# Altium schematic sheet connections.schdoc
size 209 x 297 mm; Scale: 1:1; DocumentType: Схема электрическая принципиальная; FirstReferrence: АБВГ.123456.001; PageSetup: Record=PageOptions|CenterHorizontal=False|CenterVertical=False|PrintScale=0.95|XCorrection=0.00|YCorrection=0.00|PrintKind=1|BorderSize=5000000|LeftOffset=0|BottomOffset=0|Orientation=1|PaperLength=1000|PaperWidth=1000|Scale=100|PaperSource=15|PrintQuality=600|MediaType=1|DitherType=10|PaperKind=A4|PrintScaleMode=1
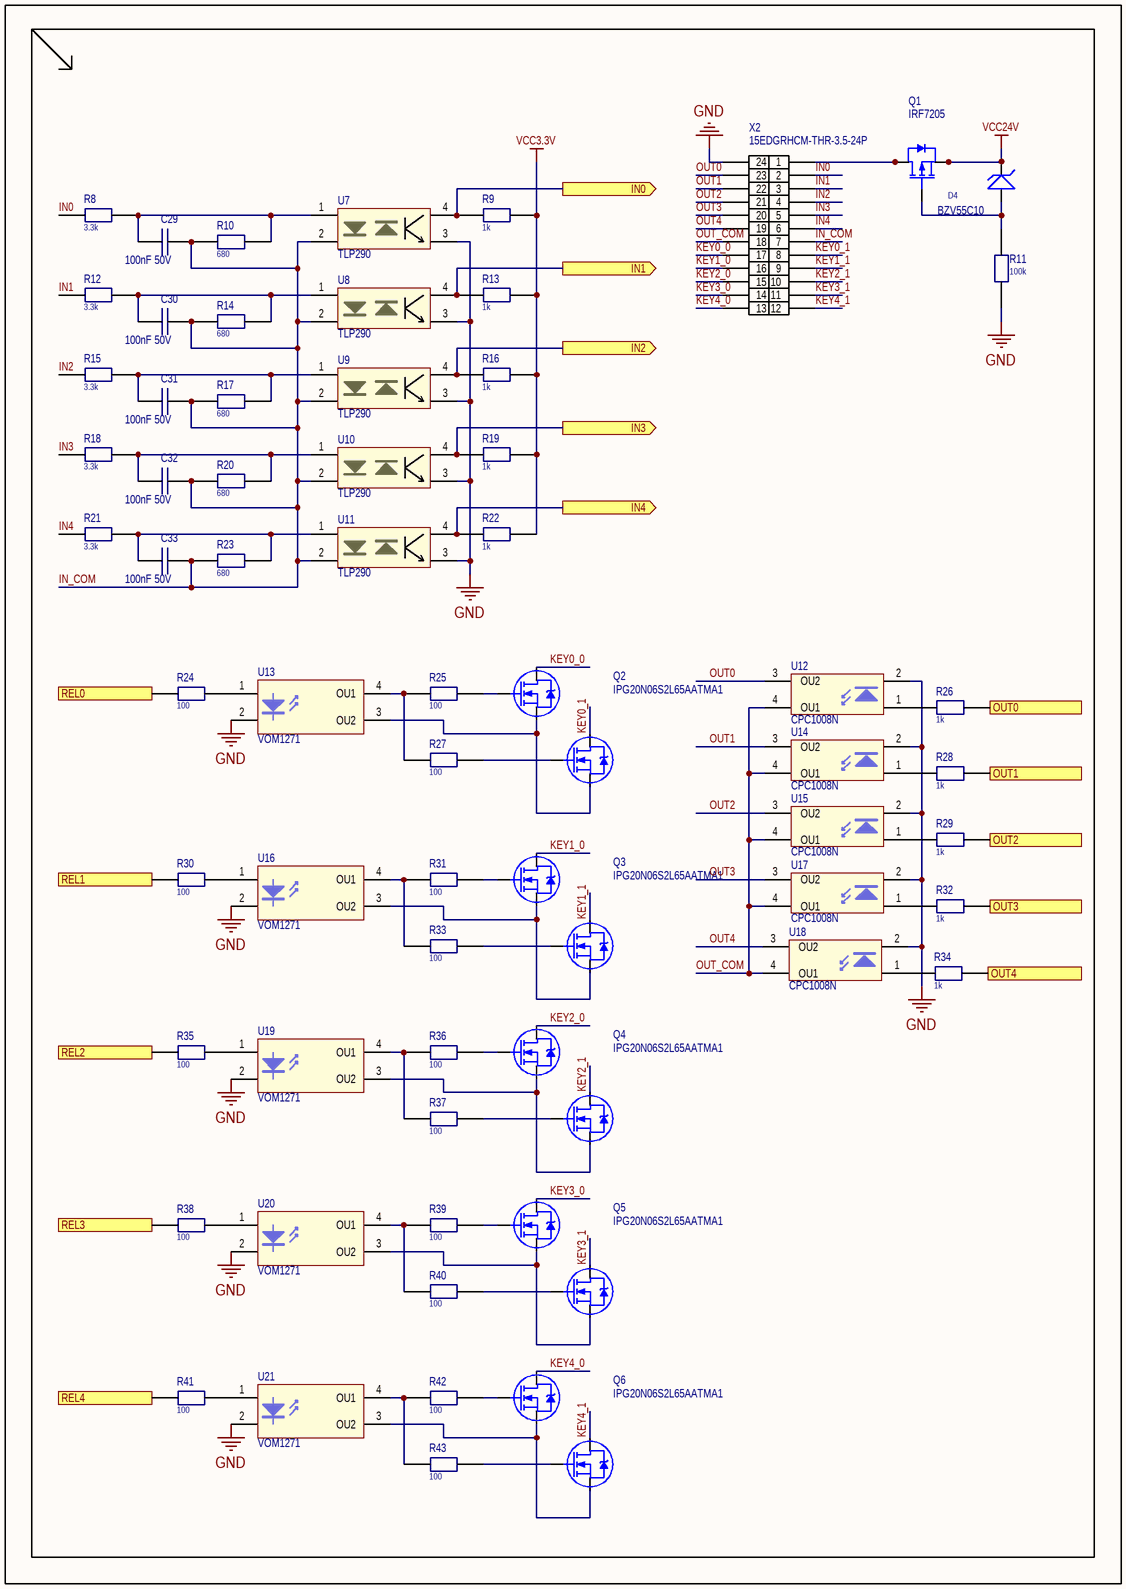
[diagram p0: connections.schdoc]

## Parts
C29  100nF 50V  [C_0603]
C30  100nF 50V  [C_0603]
C31  100nF 50V  [C_0603]
C32  100nF 50V  [C_0603]
C33  100nF 50V  [C_0603]
D4  BZV55C10  [SOD80C]
Q1  IRF7205  [SO-8_M]
Q2  IPG20N06S2L65AATMA1  [PowerFlat 5x6]
Q3  IPG20N06S2L65AATMA1  [PowerFlat 5x6]
Q4  IPG20N06S2L65AATMA1  [PowerFlat 5x6]
Q5  IPG20N06S2L65AATMA1  [PowerFlat 5x6]
Q6  IPG20N06S2L65AATMA1  [PowerFlat 5x6]
R8  3.3k  [R_0603]
R9  1k  [R_0603]
R10  680  [R_0603]
R11  100k  [R_0603]
R12  3.3k  [R_0603]
R13  1k  [R_0603]
R14  680  [R_0603]
R15  3.3k  [R_0603]
R16  1k  [R_0603]
R17  680  [R_0603]
R18  3.3k  [R_0603]
R19  1k  [R_0603]
R20  680  [R_0603]
R21  3.3k  [R_0603]
R22  1k  [R_0603]
R23  680  [R_0603]
R24  100  [R_0603]
R25  100  [R_0603]
R26  1k  [R_0603]
R27  100  [R_0603]
R28  1k  [R_0603]
R29  1k  [R_0603]
R30  100  [R_0603]
R31  100  [R_0603]
R32  1k  [R_0603]
R33  100  [R_0603]
R34  1k  [R_0603]
R35  100  [R_0603]
R36  100  [R_0603]
R37  100  [R_0603]
R38  100  [R_0603]
R39  100  [R_0603]
R40  100  [R_0603]
R41  100  [R_0603]
R42  100  [R_0603]
R43  100  [R_0603]
U7  TLP290  [SO4_1.27]
U8  TLP290  [SO4_1.27]
U9  TLP290  [SO4_1.27]
U10  TLP290  [SO4_1.27]
U11  TLP290  [SO4_1.27]
U12  CPC1008N  [SO4_2_54]
U13  VOM1271  [SOP-4]
U14  CPC1008N  [SO4_2_54]
U15  CPC1008N  [SO4_2_54]
U16  VOM1271  [SOP-4]
U17  CPC1008N  [SO4_2_54]
U18  CPC1008N  [SO4_2_54]
U19  VOM1271  [SOP-4]
U20  VOM1271  [SOP-4]
U21  VOM1271  [SOP-4]
X2  15EDGRHCM-THR-3.5-24P  [DMC 1,5/12-G1F-3,5-LRP20THRR72]

## Ports
IN0 (out), IN1 (out), IN2 (out), IN3 (out), IN4 (out), OUT0 (in), OUT1 (in), OUT2 (in), OUT3 (in), OUT4 (in), REL0 (in), REL1 (in), REL2 (in), REL3 (in), REL4 (in)

## Nets
GND: R11.2 U7.3 U8.3 U9.3 U10.3 U11.3 U12.2(K) U13.2(K) U14.2(K) U15.2(K) U16.2(K) U17.2(K) U18.2(K) U19.2(K) U20.2(K) U21.2(K) X2.24
VCC3.3V: R9.2 R13.2 R16.2 R19.2 R22.2
VCC24V: D4.2(K) Q1.1(S) Q1.2(S) Q1.3(S)
IN0: R8.1 X2.2
IN0: R9.1 U7.4 ; port IN0  [a separate net that carries the same name]
IN1: R12.1 X2.3
IN1: R13.1 U8.4 ; port IN1  [a separate net that carries the same name]
IN2: R15.1 X2.4
IN2: R16.1 U9.4 ; port IN2  [a separate net that carries the same name]
IN3: R18.1 X2.5
IN3: R19.1 U10.4 ; port IN3  [a separate net that carries the same name]
IN4: R21.1 X2.6
IN4: R22.1 U11.4 ; port IN4  [a separate net that carries the same name]
IN_COM: C29.1 C30.1 C31.1 C32.1 C33.1 R10.1 R14.1 R17.1 R20.1 R23.1 U7.2 U8.2 U9.2 U10.2 U11.2 X2.7
KEY0_0: Q2.3(D) X2.17
KEY0_1: Q2.6(D) X2.8
KEY1_0: Q3.3(D) X2.16
KEY1_1: Q3.6(D) X2.9
KEY2_0: Q4.3(D) X2.15
KEY2_1: Q4.6(D) X2.10
KEY3_0: Q5.3(D) X2.14
KEY3_1: Q5.6(D) X2.11
KEY4_0: Q6.3(D) X2.13
KEY4_1: Q6.6(D) X2.12
OUT0: U12.3(OU2) X2.23
OUT0: R26.2 ; port OUT0  [a separate net that carries the same name]
OUT1: U14.3(OU2) X2.22
OUT1: R28.2 ; port OUT1  [a separate net that carries the same name]
OUT2: U15.3(OU2) X2.21
OUT2: R29.2 ; port OUT2  [a separate net that carries the same name]
OUT3: U17.3(OU2) X2.20
OUT3: R32.2 ; port OUT3  [a separate net that carries the same name]
OUT4: U18.3(OU2) X2.19
OUT4: R34.2 ; port OUT4  [a separate net that carries the same name]
OUT_COM: U12.4(OU1) U14.4(OU1) U15.4(OU1) U17.4(OU1) U18.4(OU1) X2.18
REL0: R24.1 ; port REL0
REL1: R30.1 ; port REL1
REL2: R35.1 ; port REL2
REL3: R38.1 ; port REL3
REL4: R41.1 ; port REL4
NetC29_2: C29.2 R8.2 R10.2 U7.1
NetC30_2: C30.2 R12.2 R14.2 U8.1
NetC31_2: C31.2 R15.2 R17.2 U9.1
NetC32_2: C32.2 R18.2 R20.2 U10.1
NetC33_2: C33.2 R21.2 R23.2 U11.1
NetD4_1: D4.1(A) Q1.4(G) R11.1
NetQ1_5: Q1.5(D) Q1.6(D) Q1.7(D) Q1.8(D) X2.1
NetQ2_1: Q2.1(G) R25.2
NetQ2_2: Q2.2(S) Q2.5(S) U13.3(OU2)
NetQ2_4: Q2.4(G) R27.2
NetQ3_1: Q3.1(G) R31.2
NetQ3_2: Q3.2(S) Q3.5(S) U16.3(OU2)
NetQ3_4: Q3.4(G) R33.2
NetQ4_1: Q4.1(G) R36.2
NetQ4_2: Q4.2(S) Q4.5(S) U19.3(OU2)
NetQ4_4: Q4.4(G) R37.2
NetQ5_1: Q5.1(G) R39.2
NetQ5_2: Q5.2(S) Q5.5(S) U20.3(OU2)
NetQ5_4: Q5.4(G) R40.2
NetQ6_1: Q6.1(G) R42.2
NetQ6_2: Q6.2(S) Q6.5(S) U21.3(OU2)
NetQ6_4: Q6.4(G) R43.2
NetR24_2: R24.2 U13.1(A)
NetR25_1: R25.1 R27.1 U13.4(OU1)
NetR26_1: R26.1 U12.1(A)
NetR28_1: R28.1 U14.1(A)
NetR29_1: R29.1 U15.1(A)
NetR30_2: R30.2 U16.1(A)
NetR31_1: R31.1 R33.1 U16.4(OU1)
NetR32_1: R32.1 U17.1(A)
NetR34_1: R34.1 U18.1(A)
NetR35_2: R35.2 U19.1(A)
NetR36_1: R36.1 R37.1 U19.4(OU1)
NetR38_2: R38.2 U20.1(A)
NetR39_1: R39.1 R40.1 U20.4(OU1)
NetR41_2: R41.2 U21.1(A)
NetR42_1: R42.1 R43.1 U21.4(OU1)

## Library data of the parts
C29-C33 = CAP_SMD: Capacitor; Part Number: CC0603JPX7R9BB104; Alternative Part: *; Value: 100nF 50V
D4 = DZ_SOD80: Diode; Part Number: BZV55C10
Q1 = P-ch_SO8: 30V P-Channel  MOSFET; Part Number: IRF7205
Q2-Q6 = N-ch Dual PowerFLAT 5x6_1: Dual N-ch Mosfet; Part Number: IPG20N06S2L65AATMA1
R8 R12 R15 R18 R21 = RES_SMD: Resistor; Part Number: RC0603FR-073K3L; Alternative Part: *; Value: 3.3k
R9 R13 R16 R19 R22 R26 R28 R29 R32 R34 = RES_SMD: Resistor; Part Number: RC0603FR-071KL; Alternative Part: *; Value: 1k
R10 R14 R17 R20 R23 = RES_SMD: Resistor; Part Number: RC0603FR-07680RL; Alternative Part: *; Value: 680
R11 R24 R25 R27 R30 R31 R33 R35-R43 = RES_SMD: Resistor; Part Number: RC0603JR-07100RL; Alternative Part: *
  R11: Value: 100k
  R24 R25 R27 R30 R31 R33 R35-R43: Value: 100
U7-U11 = TLP290: 4-Pin Phototransistor Optocoupler; Published: 24-Mar-1999; LatestRevisionDate: 04-Mar-2005; LatestRevisionNote: Sch pins 3 & 4 Swapped.; DatasheetVersion: Nov-2003; PackageReference: SO-4; Publisher: Altium Limited; Part Number: TLP290; Alternative Part: *
U12 U14 U15 U17 U18 = OptoMOS_SO4: 4-Pin Phototransistor Optocoupler; Published: 24-Mar-1999; LatestRevisionDate: 04-Mar-2005; LatestRevisionNote: Sch pins 3 & 4 Swapped.; DatasheetVersion: Nov-2003; PackageReference: SO-4; Publisher: Altium Limited; Part Number: CPC1008N; Alternative Part: *
U13 U16 U19-U21 = VOM1271: Photovoltaic MOSFET Driver; Part Number: VOM1271; Alternative Part: *
X2 = DMC 1,5/12-G1F-3,5-LRP20THRR72 / 1706067: Part Number: 15EDGRHCM-THR-3.5-24P